# Altium project BACK-LIGHT.PrjPcb
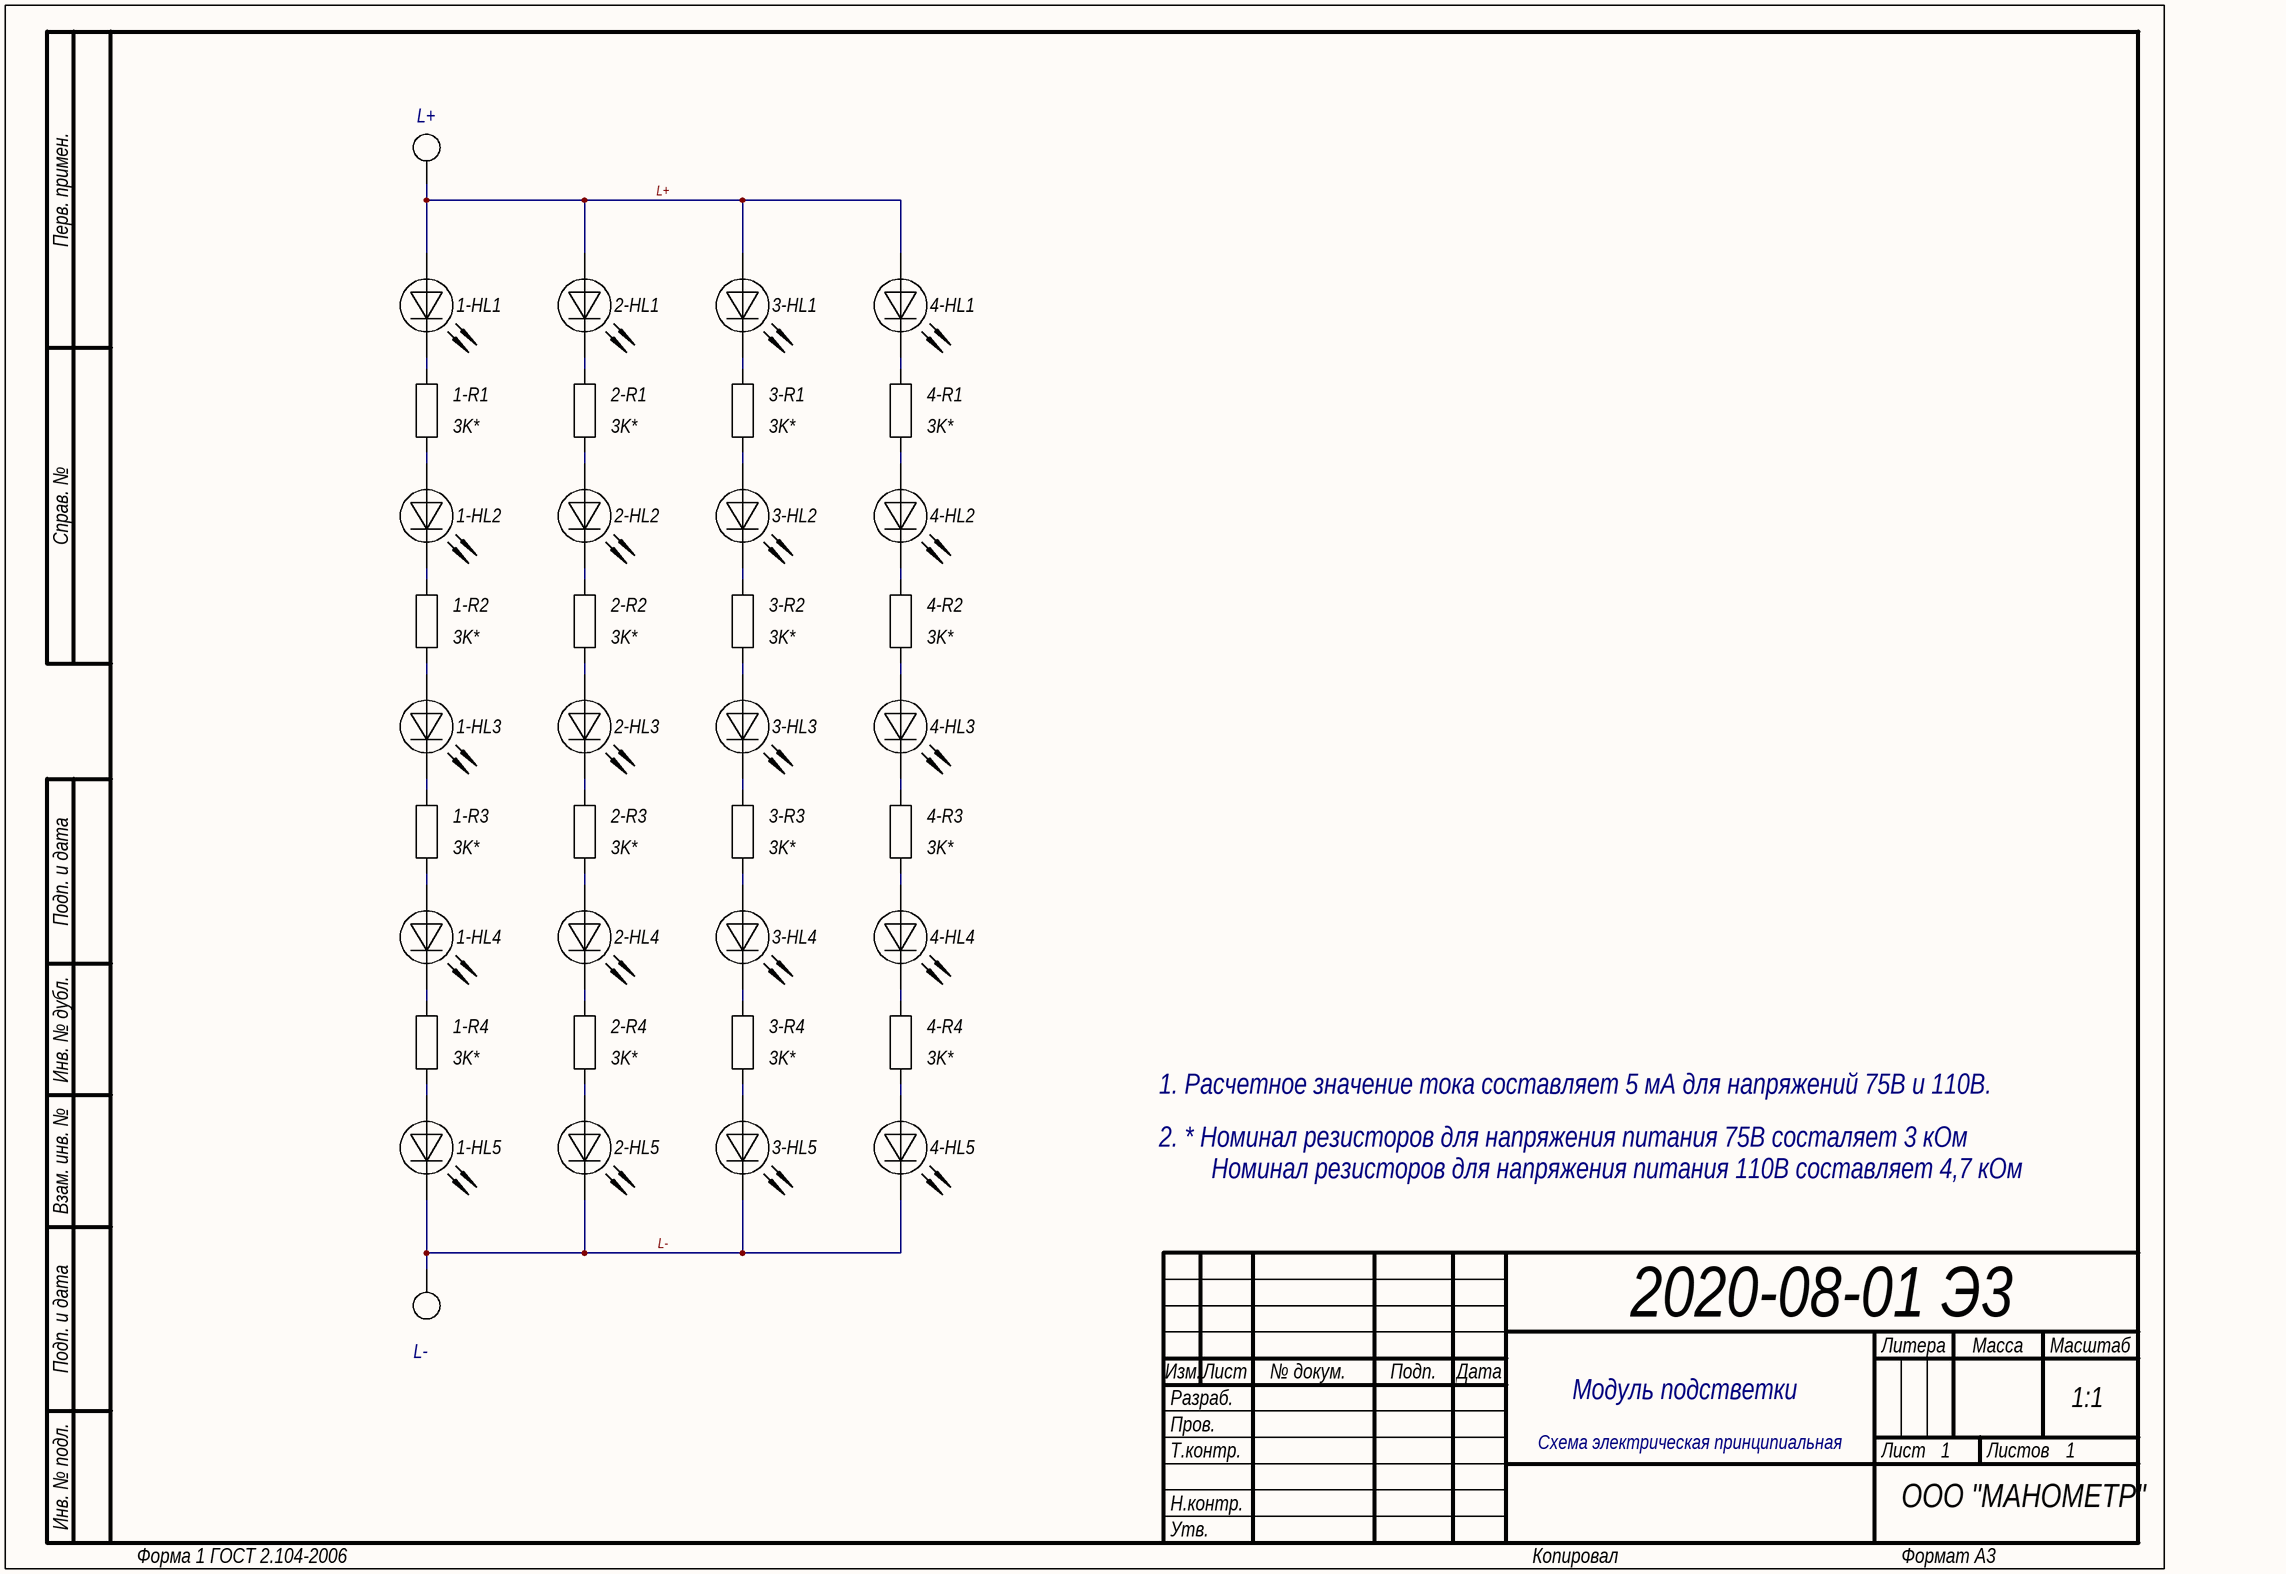
[diagram p0: BACK-LIGHT.SchDoc]
1 sheet, 38 parts. Net scope: global (net labels, ports and power ports of the same name join across sheets).
Board file: BACK-LIGHT.PcbDoc

## Sheet BACK-LIGHT.SchDoc: Модуль подстветки
size 410 x 297 mm; Organization: ООО "МАНОМЕТР"; DocumentNumber: 2020-08-01 Э3; SheetNumber: 1; SheetTotal: 1; PageSetup: 3K*; ScaleFactor: 1:1; CurrentTime: 3K*; CurrentDate: 3K*; DocumentFullPathAndName: 3K*; DocumentName: 3K*; ModifiedDate: 3K*; Rule: 3K*; ProjectName: 3K*

### Parts
1-HL1  FYLS-1206UWC  [LED 1206]  (value not drawn)
1-HL2  FYLS-1206UWC  [LED 1206]  (value not drawn)
1-HL3  FYLS-1206UWC  [LED 1206]  (value not drawn)
1-HL4  FYLS-1206UWC  [LED 1206]  (value not drawn)
1-HL5  FYLS-1206UWC  [LED 1206]  (value not drawn)
1-R1  3K*  [RC1206]
1-R2  3K*  [RC1206]
1-R3  3K*  [RC1206]
1-R4  3K*  [RC1206]
2-HL1  FYLS-1206UWC  [LED 1206]  (value not drawn)
2-HL2  FYLS-1206UWC  [LED 1206]  (value not drawn)
2-HL3  FYLS-1206UWC  [LED 1206]  (value not drawn)
2-HL4  FYLS-1206UWC  [LED 1206]  (value not drawn)
2-HL5  FYLS-1206UWC  [LED 1206]  (value not drawn)
2-R1  3K*  [RC1206]
2-R2  3K*  [RC1206]
2-R3  3K*  [RC1206]
2-R4  3K*  [RC1206]
3-HL1  FYLS-1206UWC  [LED 1206]  (value not drawn)
3-HL2  FYLS-1206UWC  [LED 1206]  (value not drawn)
3-HL3  FYLS-1206UWC  [LED 1206]  (value not drawn)
3-HL4  FYLS-1206UWC  [LED 1206]  (value not drawn)
3-HL5  FYLS-1206UWC  [LED 1206]  (value not drawn)
3-R1  3K*  [RC1206]
3-R2  3K*  [RC1206]
3-R3  3K*  [RC1206]
3-R4  3K*  [RC1206]
4-HL1  FYLS-1206UWC  [LED 1206]  (value not drawn)
4-HL2  FYLS-1206UWC  [LED 1206]  (value not drawn)
4-HL3  FYLS-1206UWC  [LED 1206]  (value not drawn)
4-HL4  FYLS-1206UWC  [LED 1206]  (value not drawn)
4-HL5  FYLS-1206UWC  [LED 1206]  (value not drawn)
4-R1  3K*  [RC1206]
4-R2  3K*  [RC1206]
4-R3  3K*  [RC1206]
4-R4  3K*  [RC1206]
L+  (no value)  [PIN]
L-  (no value)  [PIN]

### Nets
L+: 1-HL1.1(A) 2-HL1.1(A) 3-HL1.1(A) 4-HL1.1(A) L+.PIN
L-: 1-HL5.2(K) 2-HL5.2(K) 3-HL5.2(K) 4-HL5.2(K) L-.PIN
Net1-HL1_2: 1-HL1.2(K) 1-R1.1
Net1-HL2_1: 1-HL2.1(A) 1-R1.2
Net1-HL2_2: 1-HL2.2(K) 1-R2.1
Net1-HL3_1: 1-HL3.1(A) 1-R2.2
Net1-HL3_2: 1-HL3.2(K) 1-R3.1
Net1-HL4_1: 1-HL4.1(A) 1-R3.2
Net1-HL4_2: 1-HL4.2(K) 1-R4.1
Net1-HL5_1: 1-HL5.1(A) 1-R4.2
Net2-HL1_2: 2-HL1.2(K) 2-R1.1
Net2-HL2_1: 2-HL2.1(A) 2-R1.2
Net2-HL2_2: 2-HL2.2(K) 2-R2.1
Net2-HL3_1: 2-HL3.1(A) 2-R2.2
Net2-HL3_2: 2-HL3.2(K) 2-R3.1
Net2-HL4_1: 2-HL4.1(A) 2-R3.2
Net2-HL4_2: 2-HL4.2(K) 2-R4.1
Net2-HL5_1: 2-HL5.1(A) 2-R4.2
Net3-HL1_2: 3-HL1.2(K) 3-R1.1
Net3-HL2_1: 3-HL2.1(A) 3-R1.2
Net3-HL2_2: 3-HL2.2(K) 3-R2.1
Net3-HL3_1: 3-HL3.1(A) 3-R2.2
Net3-HL3_2: 3-HL3.2(K) 3-R3.1
Net3-HL4_1: 3-HL4.1(A) 3-R3.2
Net3-HL4_2: 3-HL4.2(K) 3-R4.1
Net3-HL5_1: 3-HL5.1(A) 3-R4.2
Net4-HL1_2: 4-HL1.2(K) 4-R1.1
Net4-HL2_1: 4-HL2.1(A) 4-R1.2
Net4-HL2_2: 4-HL2.2(K) 4-R2.1
Net4-HL3_1: 4-HL3.1(A) 4-R2.2
Net4-HL3_2: 4-HL3.2(K) 4-R3.1
Net4-HL4_1: 4-HL4.1(A) 4-R3.2
Net4-HL4_2: 4-HL4.2(K) 4-R4.1
Net4-HL5_1: 4-HL5.1(A) 4-R4.2

### Notes on the sheet
- 1. Расчетное значение тока составляет 5 мА для напряжений 75В и 110В.
- 2. * Номинал резисторов для напряжения питания 75В состаляет 3 кОм
- Номинал резисторов для напряжения питания 110В составляет 4,7 кОм
- Модуль подстветки
- Схема электрическая принципиальная
- Перв. примен.
- Справ. №
- Подп. и дата
- Инв. № дубл.
- Взам. инв. №
- Разраб.
- Изм.
- Лист
- № докум.
- Подп.
- Дата
- Литера
- Масса
- Масштаб
- Пров.
- Т.контр.
- Листов
- Инв. № подл.
- Н.контр.
- Утв.
- Форма 1 ГОСТ 2.104-2006
- Копировал
- Формат А3

### Library data of the parts
1-HL1-1-HL5 2-HL1-2-HL5 3-HL1-3-HL5 4-HL1-4-HL5 = LED: Светодиод; Rem: 3K*; Value: 3K*; Корпус: 3K*; Tolerance: 3K*; Power/Voltage: 3K*; Примечание: 3K*; TKE: 3K*; Part Number: 3K*; ManufacturerPartNumber: 3K*; Manufacturer: 3K*
1-R1-1-R4 2-R1-2-R4 3-R1-3-R4 4-R1-4-R4 = RES: Постоянный углеродистый резистор; Rem: 3K*; Tolerance: 3K*; Power/Voltage: 3K*; TKE: 3K*; Part Number: 3K*; ManufacturerPartNumber: 3K*; Manufacturer: 3K*; Value: 3K*; Type: 3K*
L+ L- = PIN